# EAGLE design AHNS_AP_MK3 (EAGLE 5.10)
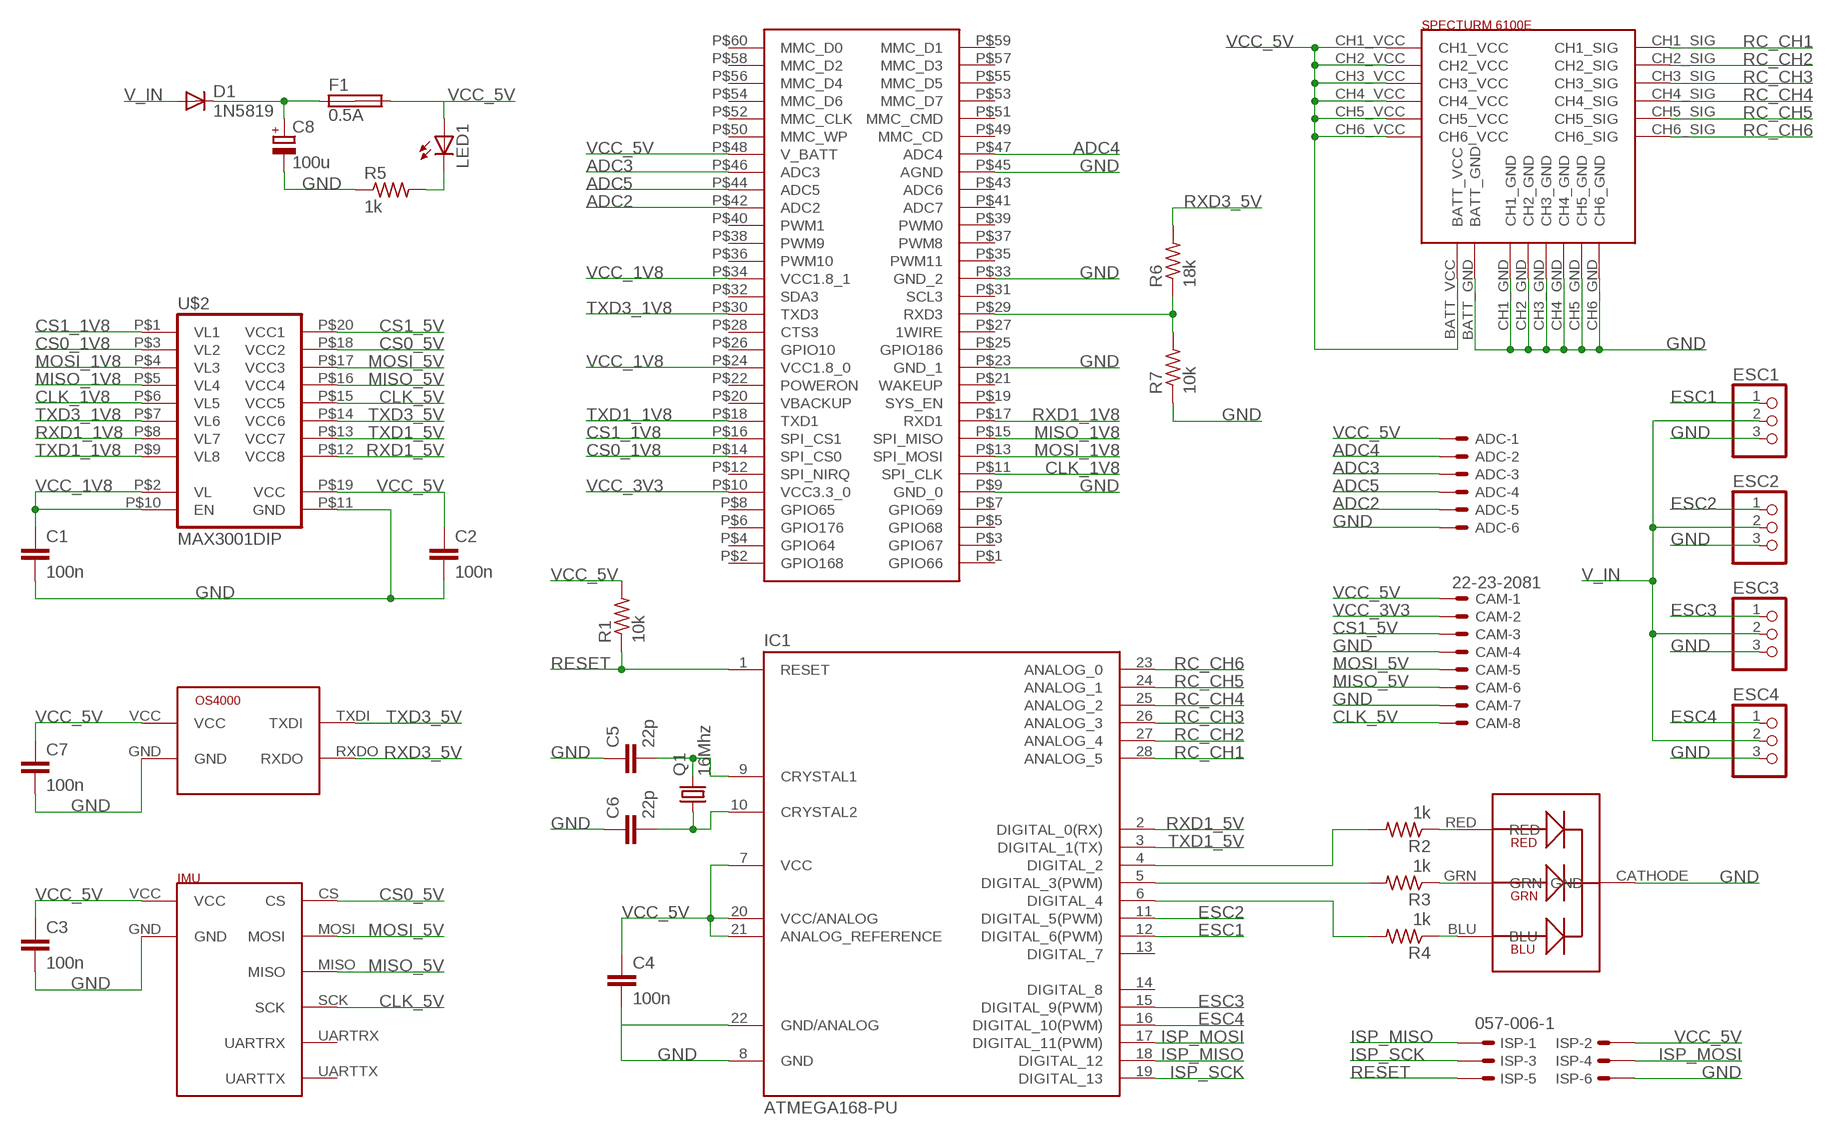
[diagram p0: schematic, sheet 1]

## Parts
ADC  22-23-2061  [22-23-2061]
C1  100n  C-EU050-024X044  [C050-024X044]
C2  100n  C-EU050-024X044  [C050-024X044]
C3  100n  C-EU050-024X044  [C050-024X044]
C4  100n  C-EU050-024X044  [C050-024X044]
C5  22p  C-EU050-024X044  [C050-024X044]
C6  22p  C-EU050-024X044  [C050-024X044]
C7  100n  C-EU050-024X044  [C050-024X044]
C8  100u  CPOL-EUE2.5-5  [E2,5-5]
CAM  22-23-2081  [22-23-2081]
D1  1N5819  1N4004  [DO41-10]
ESC1  PINHD-1X3  [1X03]
ESC2  PINHD-1X3  [1X03]
ESC3  PINHD-1X3  [1X03]
ESC4  PINHD-1X3  [1X03]
F1  0.5A  SHK20L  [SHK20L]
IC1  ATMEGA168-PU  [DIL28-3]
ISP  057-006-1  [057-006-1]
LED1  LED3MM  [LED3MM]
Q1  16Mhz  CRYSTALHC49U70  [HC49U70]
R1  10k  R-US_0207/10  [0207/10]
R2  1k  R-US_0207/10  [0207/10]
R3  1k  R-US_0207/10  [0207/10]
R4  1k  R-US_0207/10  [0207/10]
R5  1k  R-US_0207/10  [0207/10]
R6  18k  R-US_0207/10  [0207/10]
R7  10k  R-US_0207/10  [0207/10]
U$1  PINTO  [PINTO]
U$2  MAX3001DIP  [DIP]
U$3  SEN_DYN_6DOF_IMU  [SEN_DYN_6DOF_IMU]
U$4  SPECTRUM_6100E  [SPECTRUM_6100E]
U$5  TRI_COLOR_LED  [TRI_COLOR_LED]
U$7  OS4000  [OS4000]

## Nets
ADC2: ADC.5 U$1.P$42(ADC2)
ADC3: ADC.3 U$1.P$46(ADC3)
ADC4: ADC.2 U$1.P$47(ADC4)
ADC5: ADC.4 U$1.P$44(ADC5)
CLK_1V8: U$1.P$11(SPI_CLK) U$2.P$6(VL5)
CLK_5V: CAM.8 U$2.P$15(VCC5) U$3.SCK
CS0_1V8: U$1.P$14(SPI_CS0) U$2.P$3(VL2)
CS0_5V: U$2.P$18(VCC2) U$3.CS
CS1_1V8: U$1.P$16(SPI_CS1) U$2.P$1(VL1)
CS1_5V: CAM.3 U$2.P$20(VCC1)
ESC1: ESC1.1 IC1.12(DIGITAL_6(PWM))
ESC2: ESC2.1 IC1.11(DIGITAL_5(PWM))
ESC3: ESC3.1 IC1.15(DIGITAL_9(PWM))
ESC4: ESC4.1 IC1.16(DIGITAL_10(PWM))
GND: ADC.6 C1.2 C2.2 C3.2 C4.2 C5.1 C6.1 C7.2 C8.- CAM.4 CAM.7 ESC1.3 ESC2.3 ESC3.3 ESC4.3 IC1.8(GND) IC1.22(GND/ANALOG) ISP.6 R5.1 R7.1 U$1.P$9(GND_0) U$1.P$23(GND_1) U$1.P$33(GND_2) U$1.P$45(AGND) U$2.P$11(GND) U$3.GND U$4.BATT_GND U$4.CH1_GND U$4.CH2_GND U$4.CH3_GND U$4.CH4_GND U$4.CH5_GND U$4.CH6_GND U$5.CATHODE(GND) U$7.GND
ISP_MISO: IC1.18(DIGITAL_12) ISP.1
ISP_MOSI: IC1.17(DIGITAL_11(PWM)) ISP.4
ISP_SCK: IC1.19(DIGITAL_13) ISP.3
MISO_1V8: U$1.P$15(SPI_MISO) U$2.P$5(VL4)
MISO_5V: CAM.6 U$2.P$16(VCC4) U$3.MISO
MOSI_1V8: U$1.P$13(SPI_MOSI) U$2.P$4(VL3)
MOSI_5V: CAM.5 U$2.P$17(VCC3) U$3.MOSI
N$1: C5.2 IC1.9(CRYSTAL1) Q1.2
N$2: R2.1 U$5.RED
N$3: C6.2 IC1.10(CRYSTAL2) Q1.1
N$4: R3.1 U$5.GRN
N$5: R4.1 U$5.BLU
N$6: IC1.5(DIGITAL_3(PWM)) R3.2
N$7: IC1.4(DIGITAL_2) R2.2
N$8: IC1.6(DIGITAL_4) R4.2
N$9: C8.+ D1.C F1.1A
N$10: LED1.K(C) R5.2
RC_CH1: IC1.28(ANALOG_5) U$4.CH1_SIG
RC_CH2: IC1.27(ANALOG_4) U$4.CH2_SIG
RC_CH3: IC1.26(ANALOG_3) U$4.CH3_SIG
RC_CH4: IC1.25(ANALOG_2) U$4.CH4_SIG
RC_CH5: IC1.24(ANALOG_1) U$4.CH5_SIG
RC_CH6: IC1.23(ANALOG_0) U$4.CH6_SIG
RESET: IC1.1(RESET) ISP.5 R1.1
RXD1_1V8: U$1.P$17(RXD1) U$2.P$8(VL7)
RXD1_5V: IC1.2(DIGITAL_0(RX)) U$2.P$12(VCC8)
RXD3_1V8: R6.1 R7.2 U$1.P$29(RXD3)
RXD3_5V: R6.2 U$7.RXDO
TXD1_1V8: U$1.P$18(TXD1) U$2.P$9(VL8)
TXD1_5V: IC1.3(DIGITAL_1(TX)) U$2.P$13(VCC7)
TXD3_1V8: U$1.P$30(TXD3) U$2.P$7(VL6)
TXD3_5V: U$2.P$14(VCC6) U$7.TXDI
V_IN: D1.A ESC1.2 ESC2.2 ESC3.2 ESC4.2
VCC_1V8: C1.1 U$1.P$24(VCC1.8_0) U$1.P$34(VCC1.8_1) U$2.P$2(VL) U$2.P$10(EN)
VCC_3V3: CAM.2 U$1.P$10(VCC3.3_0)
VCC_5V: ADC.1 C2.1 C3.1 C4.1 C7.1 CAM.1 F1.2A IC1.7(VCC) IC1.20(VCC/ANALOG) IC1.21(ANALOG_REFERENCE) ISP.2 LED1.A R1.2 U$1.P$48(V_BATT) U$2.P$19(VCC) U$3.VCC U$4.BATT_VCC U$4.CH1_VCC U$4.CH2_VCC U$4.CH3_VCC U$4.CH4_VCC U$4.CH5_VCC U$4.CH6_VCC U$7.VCC
Unconnected: F1.1B F1.2B IC1.13(DIGITAL_7) IC1.14(DIGITAL_8) U$1.P$1(GPIO66) U$1.P$2(GPIO168) U$1.P$3(GPIO67) U$1.P$4(GPIO64) U$1.P$5(GPIO68) U$1.P$6(GPIO176) U$1.P$7(GPIO69) U$1.P$8(GPIO65) U$1.P$12(SPI_NIRQ) U$1.P$19(SYS_EN) U$1.P$20(VBACKUP) U$1.P$21(WAKEUP) U$1.P$22(POWERON) U$1.P$25(GPIO186) U$1.P$26(GPIO10) U$1.P$27(1WIRE) U$1.P$28(CTS3) U$1.P$31(SCL3) U$1.P$32(SDA3) U$1.P$35(PWM11) U$1.P$36(PWM10) U$1.P$37(PWM8) U$1.P$38(PWM9) U$1.P$39(PWM0) U$1.P$40(PWM1) U$1.P$41(ADC7) U$1.P$43(ADC6) U$1.P$49(MMC_CD) U$1.P$50(MMC_WP) U$1.P$51(MMC_CMD) U$1.P$52(MMC_CLK) U$1.P$53(MMC_D7) U$1.P$54(MMC_D6) U$1.P$55(MMC_D5) U$1.P$56(MMC_D4) U$1.P$57(MMC_D3) U$1.P$58(MMC_D2) U$1.P$59(MMC_D1) U$1.P$60(MMC_D0) U$3.UARTRX U$3.UARTTX

## Library data of the parts
ADC = con-molex:22-23-2061: .100" (2.54mm) Center Header - 6 Pin
C1-C7 = rcl:C-EU: CAPACITOR, European symbol
C8 = rcl:CPOL-EU: POLARIZED CAPACITOR, European symbol
CAM = con-molex:22-23-2081: .100" (2.54mm) Center Header - 8 Pin
D1 = diode:1N4004: DIODE general purpose rectifier, 1 A
ESC1-ESC4 = pinhead:PINHD-1X3: PIN HEADER
F1 = fuse:SHK20L: FUSE HOLDER 5 x 20 mm, SH contact, SHH1 Schukat, E1073 Buerklin
IC1 = Arduino-AVR:ATMEGA168-PU
ISP = con-panduit:057-006-: CONNECTOR 6-pin series 057 contact pc board low profile headers
LED1 = led:LED: LED OSRAM: - CHIPLED LG R971, LG N971, LY N971, LG Q971, LY Q971, LO R971, LY R971 LH N974, LH R974 LS Q976, LO Q976, LY Q976 LO Q996 - Hyper CHIPLED LW Q18S LB Q993, LB Q99A, LB R99A - SideLED LS A670, LO A670, LY A670, LG A670, LP A670 LB A673, LV A673, LT A673, LW A673 LH A674 LY A675 LS A676, LA A676, LO A676, LY A676, LW A676 LS A679, LY A679, LG A679 - Hyper Micro SIDELED® LS Y876, LA Y876, LO Y876, LY Y876 LT Y87S - SmartLED LW L88C, LW L88S LB L89C, LB L89S, LG L890 LS L89K, LO L89K, LY L89K LS L896, LA L896, LO L896, LY L896 - TOPLED LS T670, LO T670, LY T670, LG T670, LP T670 LSG T670, LSP T670, LSY T670, LOP T670, LYG T670 LG T671, LOG T671, LSG T671 LB T673, LV T673, LT T673, LW T673 LH T674 LS T676, LA T676, LO T676, LY T676, LB T676, LH T676, LSB T676, LW T676 LB T67C, LV T67C, LT T67C, LS T67K, LO T67K, LY T67K, LW E67C LS E67B, LA E67B, LO E67B, LY E67B, LB E67C, LV E67C, LT E67C LW T67C LS T679, LY T679, LG T679 LS T770, LO T770, LY T770, LG T770, LP T770 LB T773, LV T773, LT T773, LW T773 LH T774 LS E675, LA E675, LY E675, LS T675 LS T776, LA T776, LO T776, LY T776, LB T776 LHGB T686 LT T68C, LB T68C - Hyper Mini TOPLED® LB M676 - Mini TOPLED Santana® LG M470 LS M47K, LO M47K, LY M47K Source: http://www.osram.convergy.de LUXEON: - LUMILED® LXK2-PW12-R00, LXK2-PW12-S00, LXK2-PW14-U00, LXK2-PW14-V00 LXK2-PM12-R00, LXK2-PM12-S00, LXK2-PM14-U00 LXK2-PE12-Q00, LXK2-PE12-R00, LXK2-PE12-S00, LXK2-PE14-T00, LXK2-PE14-U00 LXK2-PB12-K00, LXK2-PB12-L00, LXK2-PB12-M00, LXK2-PB14-N00, LXK2-PB14-P00, LXK2-PB14-Q00 LXK2-PR12-L00, LXK2-PR12-M00, LXK2-PR14-Q00, LXK2-PR14-R00 LXK2-PD12-Q00, LXK2-PD12-R00, LXK2-PD12-S00 LXK2-PH12-R00, LXK2-PH12-S00 LXK2-PL12-P00, LXK2-PL12-Q00, LXK2-PL12-R00 Source: www.luxeon.com KINGBRIGHT: KA-3528ASYC Source: www.kingbright.com
Q1 = crystal:CRYSTAL: CRYSTAL
R1-R7 = rcl:R-US_: RESISTOR, American symbol
U$1 = AHNS10:PINTO
U$2 = maxim-11:MAX3001DIP
U$3 = AHNS10:SEN_DYN_6DOF_IMU
U$4 = AHNS10:SPECTRUM_6100E
U$5 = AHNS10:TRI_COLOR_LED
U$7 = AHNS10:OS4000

## Board
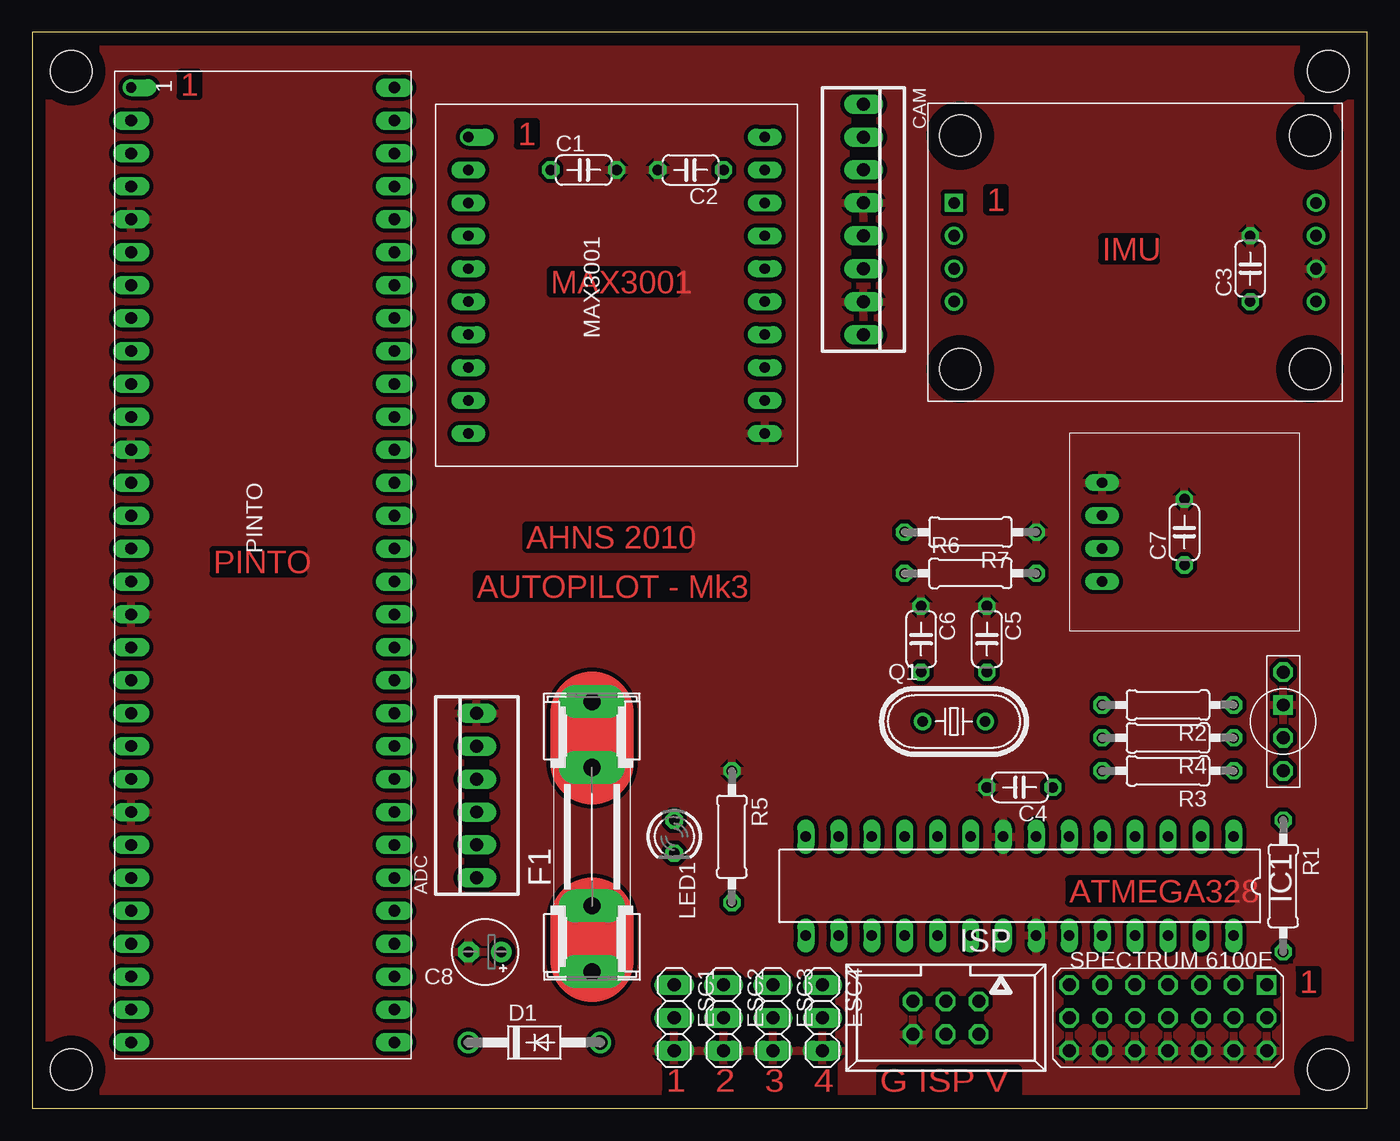
[diagram p1: board, top side]
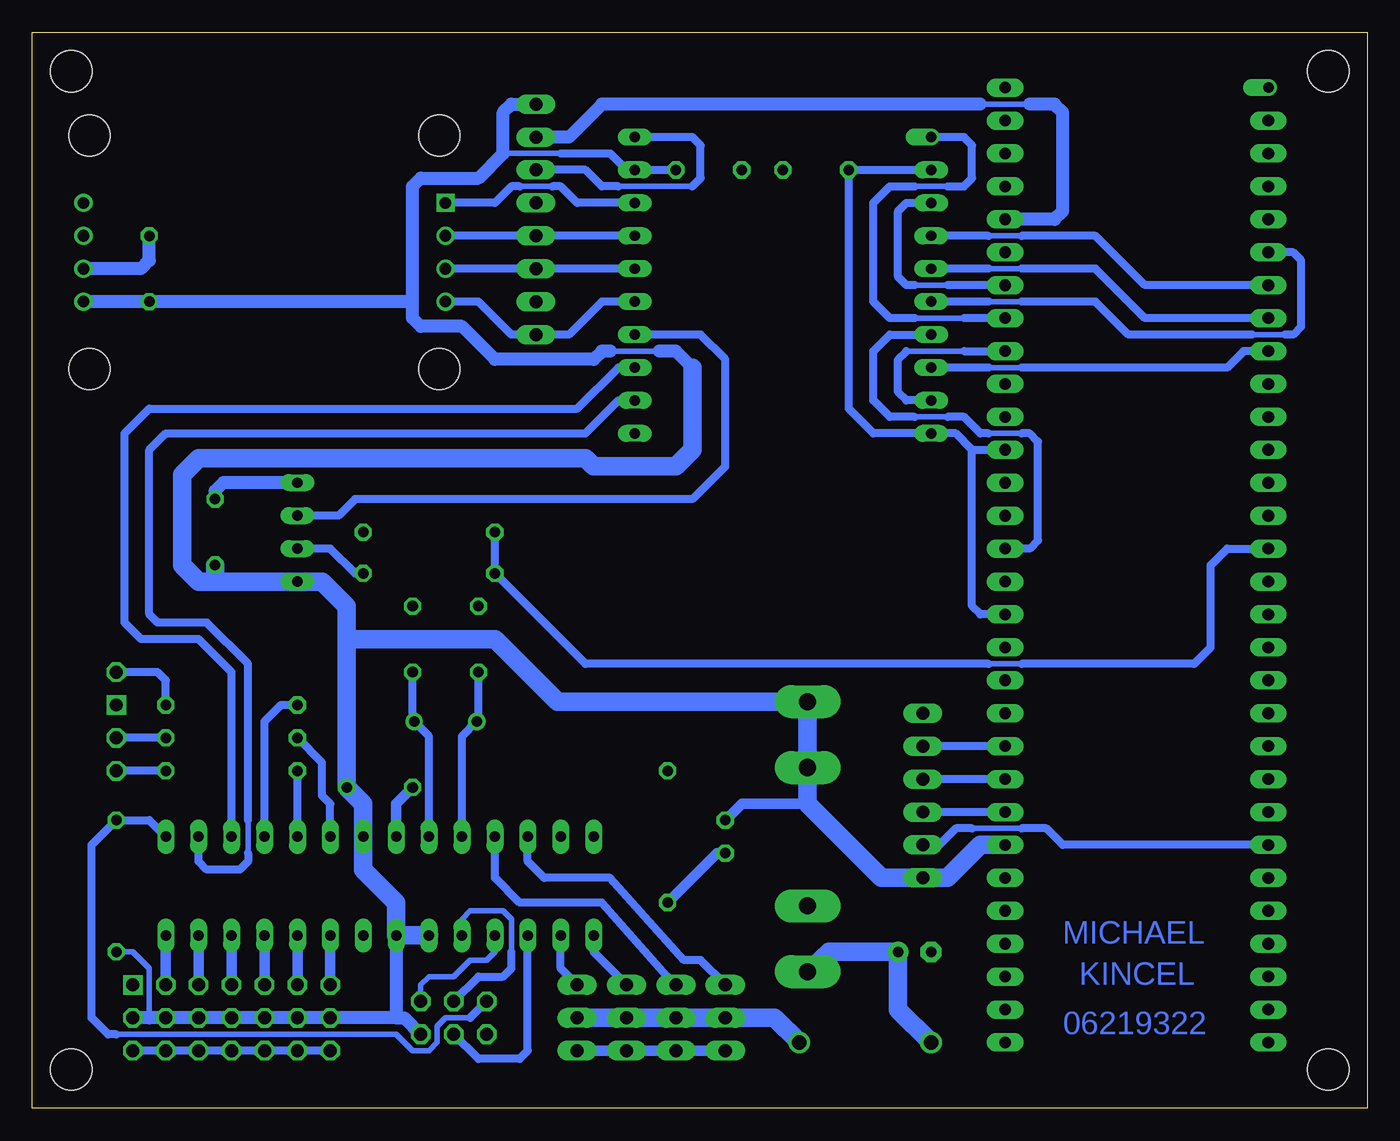
[diagram p2: board, bottom side, seen from below]

Size 103 x 83 mm. Coordinates in mm from the lower left corner, seen from the top.
Outline: 0,0 103,0 103,83 0,83 0,0
Copper layers (1*16): Top 0.035mm / dielectric 1.5mm / Bottom 0.035mm
Design rules "default": minimum track width 10mil, minimum drill 24mil, track to track 8mil, track to pad 8mil, pad to pad 8mil, via to via 8mil, smd to smd 8mil, copper to edge 40mil, drill to drill 8mil, minimum pad ring 10mil, minimum via ring 8mil, stop-mask expansion 4mil, vias tented up to drill 0mil, thermal gap 10mil
Holes 3.2 mm at 3,3 100,3 100,80 3,80

### Footprints (pad centres in the part's own frame; a part is rotated, then mirrored left to right if it is on the bottom)
22-23-2061 = drill 1 long: 1 -6.35,0; 2 -3.81,0; 3 -1.27,0; 4 1.27,0; 5 3.81,0; 6 6.35,0
C050-024X044 = drill 0.813 octagon: 1 -2.54,0; 2 2.54,0
E2,5-5 = drill 0.813 pad 1.6 round: + -1.27,0 | drill 0.813 pad 1.6 octagon: - 1.27,0
22-23-2081 = drill 1 long: 1 -8.89,0; 2 -6.35,0; 3 -3.81,0; 4 -1.27,0; 5 1.27,0; 6 3.81,0; 7 6.35,0; 8 8.89,0
DO41-10 = drill 1.118 round: A 5.08,0; C -5.08,0
1X03 = drill 1.016 long: 1 -2.54,0; 2 0,0; 3 2.54,0
SHK20L = drill 1.321 pad 2.54 long: 1A -10.414,0; 1B -5.334,0; 2A 10.414,0; 2B 5.334,0
DIL28-3 = drill 0.813 long: 1 -16.51,-3.81; 2 -13.97,-3.81; 3 -11.43,-3.81; 4 -8.89,-3.81; 5 -6.35,-3.81; 6 -3.81,-3.81; 7 -1.27,-3.81; 8 1.27,-3.81; 9 3.81,-3.81; 10 6.35,-3.81; 11 8.89,-3.81; 12 11.43,-3.81; 13 13.97,-3.81; 14 16.51,-3.81; 15 16.51,3.81; 16 13.97,3.81; 17 11.43,3.81; 18 8.89,3.81; 19 6.35,3.81; 20 3.81,3.81; 21 1.27,3.81; 22 -1.27,3.81; 23 -3.81,3.81; 24 -6.35,3.81; 25 -8.89,3.81; 26 -11.43,3.81; 27 -13.97,3.81; 28 -16.51,3.81
057-006-1 = drill 1 octagon: 1 -2.54,-1.27; 2 -2.54,1.27; 3 0,-1.27; 4 0,1.27; 5 2.54,-1.27; 6 2.54,1.27
LED3MM = drill 0.813 octagon: A -1.27,0; K 1.27,0
HC49U70 = drill 0.813 round: 1 -2.413,0; 2 2.413,0
0207/10 = drill 0.813 octagon: 1 -5.08,0; 2 5.08,0
PINTO = drill 0.8 offset: P$1 1.27,1.27 | drill 0.9 long: P$2 1.27,21.59; P$3 3.81,1.27; P$4 3.81,21.59; P$5 6.35,1.27; P$6 6.35,21.59; P$7 8.89,1.27; P$8 8.89,21.59; P$9 11.43,1.27; P$10 11.43,21.59; P$11 13.97,1.27; P$12 13.97,21.59; P$13 16.51,1.27; P$14 16.51,21.59; P$15 19.05,1.27; P$16 19.05,21.59; P$17 21.59,1.27; P$18 21.59,21.59; P$19 24.13,1.27; P$20 24.13,21.59; P$21 26.67,1.27; P$22 26.67,21.59; P$23 29.21,1.27; P$24 29.21,21.59; P$25 31.75,1.27; P$26 31.75,21.59; P$27 34.29,1.27; P$28 34.29,21.59; P$29 36.83,1.27; P$30 36.83,21.59; P$31 39.37,1.27; P$32 39.37,21.59; P$33 41.91,1.27; P$34 41.91,21.59; P$35 44.45,1.27; P$36 44.45,21.59; P$37 46.99,1.27; P$38 46.99,21.59; P$39 49.53,1.27; P$40 49.53,21.59; P$41 52.07,1.27; P$42 52.07,21.59; P$43 54.61,1.27; P$44 54.61,21.59; P$45 57.15,1.27; P$46 57.15,21.59; P$47 59.69,1.27; P$48 59.69,21.59; P$49 62.23,1.27; P$50 62.23,21.59; P$51 64.77,1.27; P$52 64.77,21.59; P$53 67.31,1.27; P$54 67.31,21.59; P$55 69.85,1.27; P$56 69.85,21.59; P$57 72.39,1.27; P$58 72.39,21.59; P$59 74.93,1.27; P$60 74.93,21.59
DIP = drill 0.8 offset: P$1 2.54,2.54 | drill 0.8 long: P$2 5.08,2.54; P$3 7.62,2.54; P$4 10.16,2.54; P$5 12.7,2.54; P$6 15.24,2.54; P$7 17.78,2.54; P$8 20.32,2.54; P$9 22.86,2.54; P$10 25.4,2.54; P$11 25.4,25.4; P$12 22.86,25.4; P$13 20.32,25.4; P$14 17.78,25.4; P$15 15.24,25.4; P$16 12.7,25.4; P$17 10.16,25.4; P$18 7.62,25.4; P$19 5.08,25.4; P$20 2.54,25.4
SEN_DYN_6DOF_IMU = drill 0.9 square: CS 13.97,-3.81 | drill 0.9 round: GND -13.97,1.27; MISO 13.97,1.27; MOSI 13.97,-1.27; SCK 13.97,3.81; UARTRX -13.97,-1.27; UARTTX -13.97,-3.81; VCC -13.97,3.81 | hole 3.2: -13.5,-9; 13.5,-9; 13.5,9; -13.5,9
SPECTRUM_6100E = drill 1 octagon: BATT_GND 2.54,7.62; BATT_VCC 0,7.62; CH1_GND 2.54,5.08; CH1_SIG -2.54,5.08; CH1_VCC 0,5.08; CH2_GND 2.54,2.54; CH2_SIG -2.54,2.54; CH2_VCC 0,2.54; CH3_GND 2.54,0; CH3_SIG -2.54,0; CH3_VCC 0,0; CH4_GND 2.54,-2.54; CH4_SIG -2.54,-2.54; CH4_VCC 0,-2.54; CH5_GND 2.54,-5.08; CH5_SIG -2.54,-5.08; CH5_VCC 0,-5.08; CH6_GND 2.54,-7.62; CH6_SIG -2.54,-7.62; CH6_VCC 0,-7.62 | drill 1 square: NC -2.54,7.62
TRI_COLOR_LED = drill 1 octagon: BLU 1.27,0; GRN 3.81,0; RED -3.81,0 | drill 1 square: CATHODE -1.27,0
OS4000 = drill 0.8 long: GND 6.35,-3.81; RXDO 6.35,1.27; TXDI 6.35,-1.27; VCC 6.35,3.81

### Placement (x,y rotation side)
ADC  34.29,24.13 90 top
C1  42.55,72.39 0 top
C2  50.8,72.39 180 top
C3  93.98,64.77 90 top
C4  76.2,24.77 180 top
C5  73.66,36.2 270 top
C6  68.58,36.2 270 top
C7  88.9,44.45 90 top
C8  34.92,12.06 180 top
CAM  64.14,68.58 270 top
D1  38.73,5.08 0 top
ESC1  49.53,6.99 270 top
ESC2  53.34,6.99 270 top
ESC3  57.15,6.99 270 top
ESC4  60.96,6.99 270 top
F1  43.18,20.95 90 top
IC1  76.2,17.14 180 top
ISP  70.48,6.99 180 top
LED1  49.53,20.95 270 top
Q1  71.12,29.84 0 top
R1  96.52,17.14 270 top
R2  87.63,31.11 180 top
R3  87.63,26.04 180 top
R4  87.63,28.57 180 top
R5  53.98,20.95 270 top
R6  72.39,41.27 0 top
R7  72.39,44.45 180 top
U$1  6.35,80.01 270 top
U$2  31.11,77.47 270 top
U$3  85.09,66.04 180 top
U$4  87.63,6.99 270 top
U$5  96.52,29.84 270 top
U$7  88.9,44.45 180 top

### Tracks (layer width: path | path; a pad name or v marks a point on that pad's centre or on a via)
ADC2
  Bottom 0.61: U$1.P$42 ADC.5
ADC3
  Bottom 0.61: U$1.P$46 ADC.3
ADC4
  Bottom 0.406: 26.67,21.59 30.48,21.59
  Bottom 0.61: ADC.2 33.02,20.32 31.75,21.59 30.48,21.59 | 26.67,21.59 24.77,21.59 23.5,20.32 U$1.P$47
ADC5
  Bottom 0.61: U$1.P$44 ADC.4
CLK_1V8
  Bottom 0.406: 26.67,62.23 29.21,62.23 | 6.35,59.69 8.89,59.69
  Bottom 0.61: 29.21,62.23 U$2.P$6 | 26.67,62.23 20.95,62.23 18.41,59.69 8.89,59.69 | 6.35,59.69 5.71,59.69 5.08,60.33 5.08,65.41 5.71,66.04 U$1.P$11
CLK_5V
  Bottom 0.61: U$3.SCK 68.58,62.23 66.04,59.69 CAM.8 61.59,59.69 59.05,62.23 U$2.P$15
CS0_1V8
  Bottom 0.406: 32.38,63.5 34.92,63.5
  Bottom 0.61: U$1.P$14 32.38,63.5 | 34.92,63.5 35.56,63.5 36.2,64.14 36.2,69.22 35.56,69.85 U$2.P$3
CS0_5V
  Bottom 0.406: 62.87,71.12 65.41,71.12
  Bottom 0.61: U$3.CS 67.31,69.85 66.04,71.12 65.41,71.12 | 62.87,71.12 62.23,71.12 60.96,69.85 U$2.P$18
CS1_1V8
  Bottom 0.406: 31.11,60.96 34.92,60.96 | 34.92,71.12 32.38,71.12
  Bottom 0.61: U$1.P$16 31.11,60.96 | 34.92,60.96 36.83,60.96 38.1,62.23 38.1,69.85 36.83,71.12 34.92,71.12 | 32.38,71.12 31.11,71.12 30.48,71.75 30.48,74.3 31.11,74.93 U$2.P$1
CS1_5V
  Bottom 0.406: 52.07,71.12 57.78,71.12
  Bottom 0.61: CAM.3 60.33,72.39 59.05,71.12 57.78,71.12 | 52.07,71.12 51.44,71.75 51.44,74.3 52.07,74.93 U$2.P$20
ESC1
  Bottom 0.61: ESC1.1 51.44,11.43 52.7,11.43 58.42,17.78 63.5,17.78 64.77,19.05 IC1.12
ESC2
  Bottom 0.61: ESC2.1 53.98,10.16 59.05,15.88 65.41,15.88 67.31,17.78 IC1.11
ESC3
  Bottom 0.61: ESC3.1 59.69,12.06 IC1.15
ESC4
  Bottom 0.61: ESC4.1 62.23,10.79 IC1.16
GND
  Bottom 0.61: U$4.CH6_GND U$4.CH5_GND U$4.CH4_GND U$4.CH3_GND U$4.CH2_GND U$4.CH1_GND U$4.BATT_GND
  Bottom 0.813: ESC1.3 ESC4.3 | IC1.8 74.93,23.5 C4.2
  Bottom 1.016: U$3.GND 94.61,64.77 93.98,65.41 C3.2 | U$7.GND 88.27,48.26 88.9,47.62 C7.2
  pour Top (isolate 0.305): 0,0 103,0 103,83 0,83
ISP_MISO
  Bottom 0.406: ISP.1 73.03,9.53 72.39,10.16 70.48,10.16 69.22,11.43 67.94,11.43 67.31,12.06 IC1.18
ISP_MOSI
  Bottom 0.61: ISP.4 68.58,3.81 65.41,3.81 64.77,4.45 IC1.17
ISP_SCK
  Bottom 0.406: 66.04,12.06 66.04,14.61 66.67,15.24 69.22,15.24 69.85,14.61 IC1.19
  Bottom 0.61: ISP.3 68.58,10.16 66.67,10.16 66.04,10.79 66.04,12.06
MISO_1V8
  Bottom 0.406: 26.67,64.77 29.21,64.77
  Bottom 0.61: 29.21,64.77 U$2.P$5 | 26.67,64.77 20.95,64.77 17.14,60.96 U$1.P$15
MISO_5V
  Bottom 0.61: U$3.MISO CAM.6 U$2.P$16
MOSI_1V8
  Bottom 0.406: 26.67,67.31 29.21,67.31
  Bottom 0.61: 29.21,67.31 U$2.P$4 | 26.67,67.31 20.95,67.31 17.14,63.5 U$1.P$13
MOSI_5V
  Bottom 0.61: U$3.MOSI CAM.5 U$2.P$17
N$1
  Bottom 0.61: IC1.9 72.39,28.7 Q1.2 73.66,29.84 C5.2
N$2
  Bottom 0.61: R2.1 92.71,33.02 93.34,33.66 U$5.RED
N$3
  Bottom 0.61: IC1.10 69.85,28.7 Q1.1 68.58,29.84 C6.2
N$4
  Bottom 0.61: R3.1 U$5.GRN
N$5
  Bottom 0.61: R4.1 U$5.BLU
N$6
  Bottom 0.61: IC1.5 R3.2
N$7
  Bottom 0.61: IC1.4 85.09,29.84 83.82,31.11 R2.2
N$8
  Bottom 0.61: IC1.6 80.01,23.5 80.64,24.13 80.64,26.67 R4.2
N$9
  Bottom 1.422: D1.C 36.2,7.62 C8.+ 41.53,12.06 F1.1A
N$10
  Bottom 0.813: LED1.K 50.16,19.68 R5.2
N$12
  Top 6.452: 43.18,11.43 43.18,14.61
N$13
  Top 6.452: 43.18,26.67 43.18,30.48
RC_CH1
  Bottom 0.813: U$4.CH1_SIG IC1.28
RC_CH2
  Bottom 0.813: U$4.CH2_SIG IC1.27
RC_CH3
  Bottom 0.813: U$4.CH3_SIG IC1.26
RC_CH4
  Bottom 0.813: U$4.CH4_SIG IC1.25
RC_CH5
  Bottom 0.813: U$4.CH5_SIG IC1.24
RC_CH6
  Bottom 0.813: U$4.CH6_SIG IC1.23
RESET
  Bottom 0.406: 69.22,6.99 71.12,6.99 71.75,6.35 71.75,5.08 72.39,4.45 73.66,4.45 74.93,5.71 96.52,5.71
  Bottom 0.61: ISP.5 69.22,6.99 | 96.52,5.71 97.16,5.71 98.42,6.99 98.42,20.32 R1.1 93.98,22.23 IC1.1
RXD1_1V8
  Bottom 0.406: 26.67,57.15 29.21,57.15
  Bottom 0.61: 29.21,57.15 U$2.P$8 | 26.67,57.15 10.79,57.15 9.53,58.42 U$1.P$17
RXD1_5V
  Bottom 0.406: 86.36,19.68 86.36,22.23
  Bottom 0.61: IC1.2 90.17,19.05 89.53,18.41 87,18.41 86.36,19.05 86.36,19.68 | 86.36,22.23 86.36,34.29 89.53,37.47 93.34,37.47 93.98,38.1 93.98,50.8 92.71,52.07 60.33,52.07 57.78,54.61 U$2.P$12
RXD3_1V8
  Bottom 0.406: 26.67,34.29 29.21,34.29
  Bottom 0.61: U$1.P$29 10.79,43.18 12.06,41.91 12.06,35.56 13.34,34.29 26.67,34.29 | 29.21,34.29 60.33,34.29 R6.1 R7.2
RXD3_5V
  Bottom 0.61: U$7.RXDO 80.01,43.18 78.11,41.27 R6.2
TXD1_1V8
  Bottom 0.406: 35.56,58.42 31.11,58.42
  Bottom 0.61: 35.56,58.42 36.2,57.78 36.2,55.24 35.56,54.61 U$2.P$9 | 31.11,58.42 U$1.P$18
TXD1_5V
  Bottom 0.61: IC1.3 87.63,33.66 90.17,36.2 94.61,36.2 95.89,37.47 95.89,52.07 93.98,53.98 60.96,53.98 57.78,57.15 U$2.P$13
TXD3_1V8
  Bottom 0.406: 26.67,52.07 29.21,52.07 | 32.38,53.34 34.92,53.34
  Bottom 0.61: U$1.P$30 26.04,43.18 25.4,43.81 25.4,51.44 26.04,52.07 26.67,52.07 | 29.21,52.07 29.84,52.07 31.11,53.34 32.38,53.34 | 34.92,53.34 36.83,53.34 38.1,54.61 38.1,58.42 36.83,59.69 U$2.P$7
TXD3_5V
  Bottom 0.61: U$2.P$14 51.44,59.69 49.53,57.78 49.53,49.53 52.07,46.99 78.11,46.99 79.38,45.72 U$7.TXDI
V_IN
  Bottom 1.422: ESC4.2 ESC3.2 ESC2.2 ESC1.2 45.72,6.99 D1.A
VCC_1V8
  Bottom 0.61: 30.48,50.8 U$1.P$24 | U$2.P$2 C1.1 40.01,53.98 38.1,52.07 U$2.P$10 31.75,52.07 30.48,50.8 | U$1.P$34 29.84,38.1 30.48,38.73 30.48,50.8
VCC_3V3
  Bottom 0.406: 26.04,77.47 29.84,77.47
  Bottom 1.016: CAM.2 61.59,74.93 59.05,77.47 29.84,77.47 | 26.04,77.47 24.13,77.47 23.5,76.83 23.5,69.22 24.13,68.58 U$1.P$10
VCC_5V
  Bottom 0.406: R1.2 95.25,12.06 93.98,10.79 93.98,6.99 | 54.61,58.42 58.42,58.42 | 66.67,73.66 62.23,73.66
  Bottom 0.61: 62.23,73.66 58.42,73.66 57.15,72.39 U$2.P$19 C2.1
  Bottom 0.813: LED1.A 48.26,23.5 43.18,23.5
  Bottom 1.016: IC1.21 74.93,6.99 | 74.93,6.99 U$4.CH6_VCC U$4.CH5_VCC U$4.CH4_VCC U$4.CH3_VCC U$4.CH2_VCC U$4.CH1_VCC 93.98,6.99 U$4.BATT_VCC | ISP.2 74.3,6.99 74.93,6.99 | U$3.VCC C3.1 73.66,62.23 | 54.61,58.42 53.34,58.42 52.07,57.15 | 58.42,58.42 59.05,58.42 59.69,57.78 67.31,57.78 69.85,60.33 73.03,60.33 73.66,60.96 73.66,62.23 | 73.66,62.23 73.66,71.12 73.03,71.75 68.58,71.75 66.67,73.66 66.67,76.83 66.04,77.47 CAM.1
  Bottom 1.422: IC1.20 IC1.21 74.93,15.88 77.47,18.41 IC1.7 77.47,23.5 C4.1 78.74,36.2 | U$1.P$48 29.84,20.32 32.38,17.78 ADC.1 37.47,17.78 43.18,23.5 F1.2A 62.48,31.37 67.31,36.2 78.74,36.2 | 78.74,36.2 78.74,38.73 80.64,40.64 U$7.VCC 88.9,40.64 | 88.9,40.64 90.17,40.64 91.44,41.91 91.44,48.9 90.17,50.16 60.33,50.16 59.69,49.53 53.34,49.53 52.07,50.8 52.07,57.15 | 88.9,40.64 C7.1

### Text on the board
Top: 1 | 1 | 1 | IMU | MAX3001 | AHNS 2010 | PINTO | AUTOPILOT - Mk3 | ATMEGA328 | 1 | 1 | 2 | 3 | 4 | G ISP V
Bottom: MICHAEL | KINCEL | 06219322